# EAGLE design Test pistes (EAGLE 7.2.0)
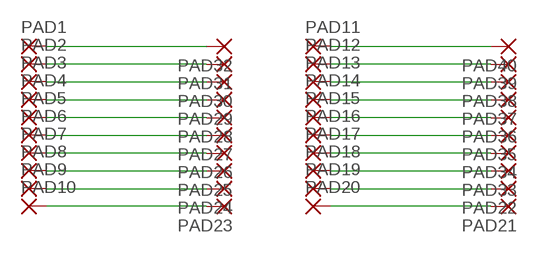
[diagram p0: schematic, sheet 1]

## Parts
PAD1  2,54/1,1  [2,54/1,1]
PAD2  2,54/1,1  [2,54/1,1]
PAD3  2,54/1,1  [2,54/1,1]
PAD4  2,54/1,1  [2,54/1,1]
PAD5  2,54/1,1  [2,54/1,1]
PAD6  2,54/1,1  [2,54/1,1]
PAD7  2,54/1,1  [2,54/1,1]
PAD8  2,54/1,1  [2,54/1,1]
PAD9  2,54/1,1  [2,54/1,1]
PAD10  2,54/1,1  [2,54/1,1]
PAD11  2,54/1,1  [2,54/1,1]
PAD12  2,54/1,1  [2,54/1,1]
PAD13  2,54/1,1  [2,54/1,1]
PAD14  2,54/1,1  [2,54/1,1]
PAD15  2,54/1,1  [2,54/1,1]
PAD16  2,54/1,1  [2,54/1,1]
PAD17  2,54/1,1  [2,54/1,1]
PAD18  2,54/1,1  [2,54/1,1]
PAD19  2,54/1,1  [2,54/1,1]
PAD20  2,54/1,1  [2,54/1,1]
PAD21  2,54/1,1  [2,54/1,1]
PAD22  2,54/1,1  [2,54/1,1]
PAD23  2,54/1,1  [2,54/1,1]
PAD24  2,54/1,1  [2,54/1,1]
PAD25  2,54/1,1  [2,54/1,1]
PAD26  2,54/1,1  [2,54/1,1]
PAD27  2,54/1,1  [2,54/1,1]
PAD28  2,54/1,1  [2,54/1,1]
PAD29  2,54/1,1  [2,54/1,1]
PAD30  2,54/1,1  [2,54/1,1]
PAD31  2,54/1,1  [2,54/1,1]
PAD32  2,54/1,1  [2,54/1,1]
PAD33  2,54/1,1  [2,54/1,1]
PAD34  2,54/1,1  [2,54/1,1]
PAD35  2,54/1,1  [2,54/1,1]
PAD36  2,54/1,1  [2,54/1,1]
PAD37  2,54/1,1  [2,54/1,1]
PAD38  2,54/1,1  [2,54/1,1]
PAD39  2,54/1,1  [2,54/1,1]
PAD40  2,54/1,1  [2,54/1,1]

## Nets
N$1: PAD1.1(P) PAD32.1(P)
N$2: PAD2.1(P) PAD31.1(P)
N$3: PAD3.1(P) PAD30.1(P)
N$4: PAD4.1(P) PAD29.1(P)
N$5: PAD5.1(P) PAD28.1(P)
N$6: PAD6.1(P) PAD27.1(P)
N$7: PAD7.1(P) PAD26.1(P)
N$8: PAD8.1(P) PAD25.1(P)
N$9: PAD9.1(P) PAD24.1(P)
N$10: PAD10.1(P) PAD23.1(P)
N$11: PAD11.1(P) PAD40.1(P)
N$12: PAD12.1(P) PAD39.1(P)
N$13: PAD13.1(P) PAD38.1(P)
N$14: PAD14.1(P) PAD37.1(P)
N$15: PAD15.1(P) PAD36.1(P)
N$16: PAD16.1(P) PAD35.1(P)
N$17: PAD17.1(P) PAD34.1(P)
N$18: PAD18.1(P) PAD33.1(P)
N$19: PAD19.1(P) PAD22.1(P)
N$20: PAD20.1(P) PAD21.1(P)

## Library data of the parts
PAD1-PAD40 = wirepad:2,54/1,1: THROUGH-HOLE PAD

## Board
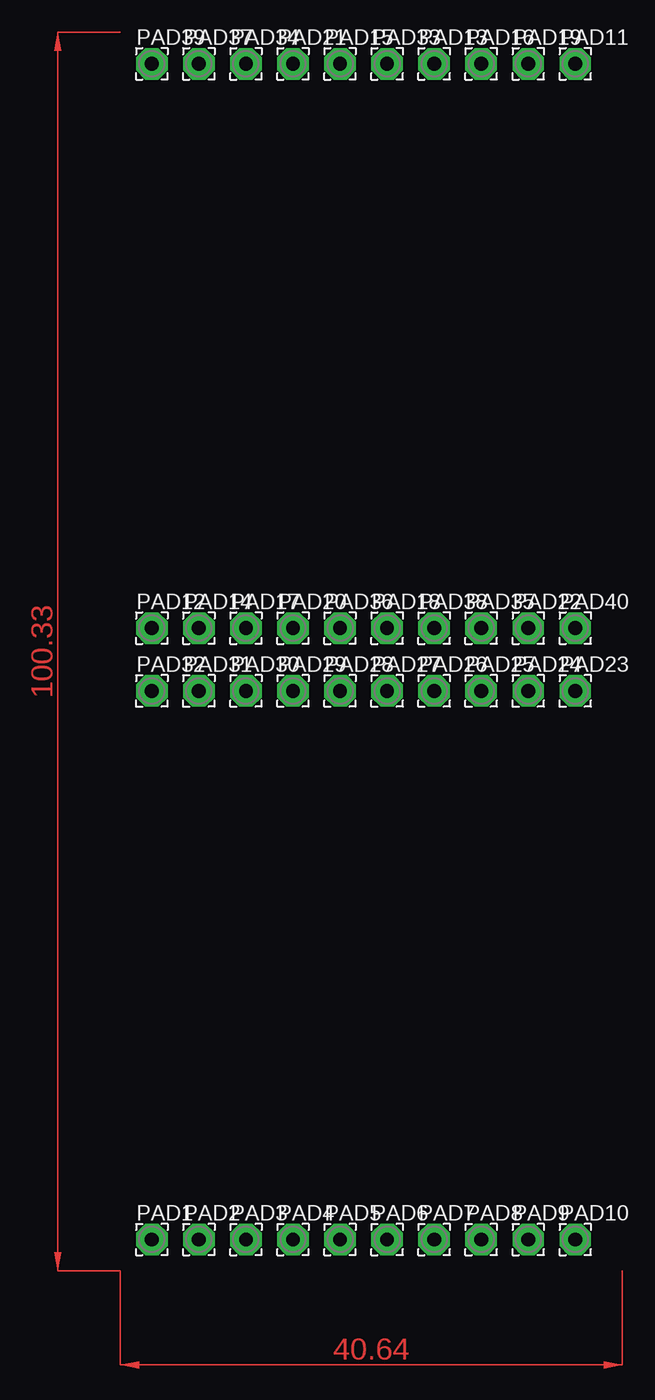
[diagram p1: board, top side]
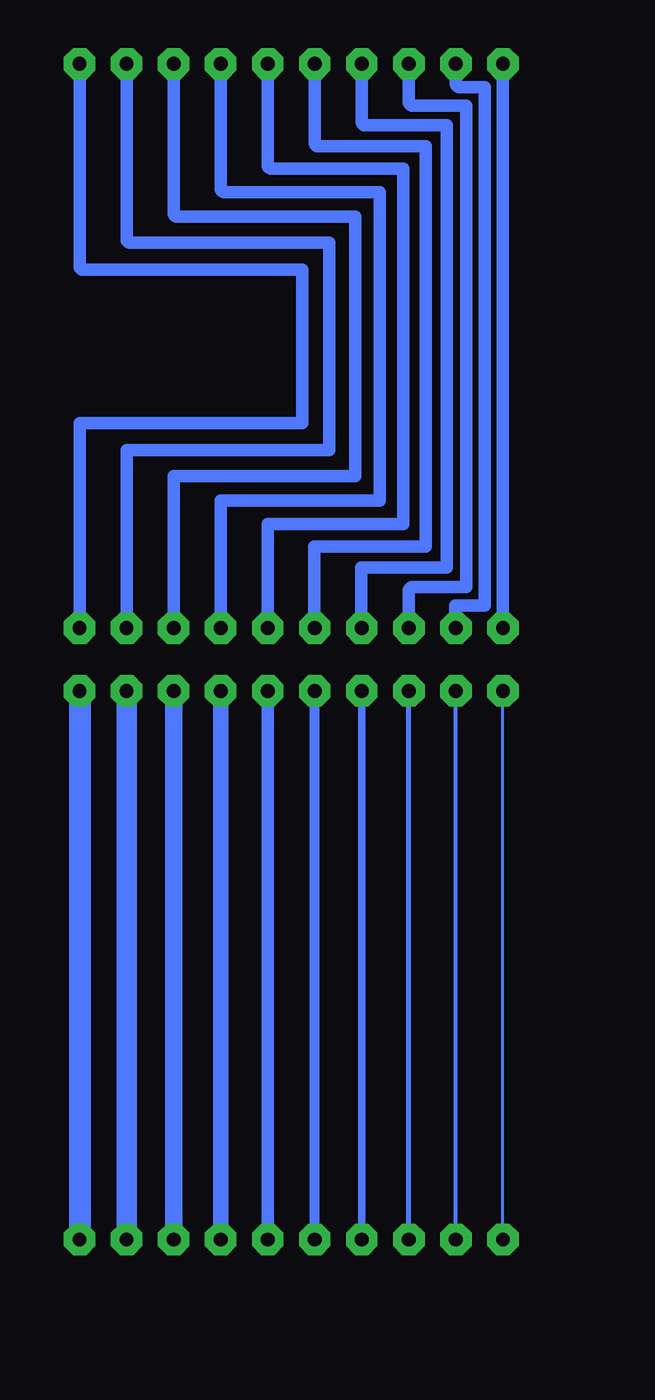
[diagram p2: board, bottom side, seen from below]

No outline drawn. Coordinates in mm, seen from the top.
Copper layers (1*16): Top 0.035mm / dielectric 1.5mm / Bottom 0.035mm
Design rules "default": minimum track width 10mil, minimum drill 24mil, track to track 8mil, track to pad 8mil, pad to pad 8mil, via to via 8mil, smd to smd 8mil, copper to edge 40mil, drill to drill 8mil, minimum pad ring 10mil, minimum via ring 8mil, stop-mask expansion 4mil, vias tented up to drill 0mil, thermal gap 10mil

### Footprints (pad centres in the part's own frame; a part is rotated, then mirrored left to right if it is on the bottom)
2,54/1,1 = drill 1.118 pad 2.54 octagon: 1 0,0

### Placement (x,y rotation side)
PAD1  2.54,2.54 0 top
PAD2  6.35,2.54 0 top
PAD3  10.16,2.54 0 top
PAD4  13.97,2.54 0 top
PAD5  17.78,2.54 0 top
PAD6  21.59,2.54 0 top
PAD7  25.4,2.54 0 top
PAD8  29.21,2.54 0 top
PAD9  33.02,2.54 0 top
PAD10  36.83,2.54 0 top
PAD11  36.83,97.79 0 top
PAD12  2.54,52.07 0 top
PAD13  25.4,97.79 0 top
PAD14  6.35,52.07 0 top
PAD15  17.78,97.79 0 top
PAD16  29.21,97.79 0 top
PAD17  10.16,52.07 0 top
PAD18  21.59,52.07 0 top
PAD19  33.02,97.79 0 top
PAD20  13.97,52.07 0 top
PAD21  13.97,97.79 0 top
PAD22  33.02,52.07 0 top
PAD23  36.83,46.99 0 top
PAD24  33.02,46.99 0 top
PAD25  29.21,46.99 0 top
PAD26  25.4,46.99 0 top
PAD27  21.59,46.99 0 top
PAD28  17.78,46.99 0 top
PAD29  13.97,46.99 0 top
PAD30  10.16,46.99 0 top
PAD31  6.35,46.99 0 top
PAD32  2.54,46.99 0 top
PAD33  21.59,97.79 0 top
PAD34  10.16,97.79 0 top
PAD35  29.21,52.07 0 top
PAD36  17.78,52.07 0 top
PAD37  6.35,97.79 0 top
PAD38  25.4,52.07 0 top
PAD39  2.54,97.79 0 top
PAD40  36.83,52.07 0 top

### Tracks (layer width: path | path; a pad name or v marks a point on that pad's centre or on a via)
N$1
  Bottom 0.254: PAD1.1 PAD32.1
N$2
  Bottom 0.305: PAD2.1 PAD31.1
N$3
  Bottom 0.406: PAD3.1 PAD30.1
N$4
  Bottom 0.61: PAD4.1 PAD29.1
N$5
  Bottom 0.813: PAD5.1 PAD28.1
N$6
  Bottom 1.016: PAD6.1 PAD27.1
N$7
  Bottom 1.27: PAD7.1 PAD26.1
N$8
  Bottom 1.422: PAD25.1 PAD8.1
N$9
  Bottom 1.676: PAD24.1 PAD9.1
N$10
  Bottom 1.778: PAD23.1 PAD10.1
N$11
  Bottom 1: PAD40.1 arc-90 36.8,52.1 36.8,68.7 18.8,68.7 18.8,81.1 36.51,81.1 arc90 36.83,81.42 PAD11.1
N$12
  Bottom 1: PAD12.1 PAD39.1
N$13
  Bottom 1: PAD38.1 25.4,62.4 12.5,62.4 12.5,87.4 25.08,87.4 arc90 25.4,87.72 PAD13.1
N$14
  Bottom 1: PAD14.1 arc90 6.4,52.12 6.4,53.9 4,53.9 4,95.9 6.03,95.9 arc90 6.35,96.22 PAD37.1
N$15
  Bottom 1: PAD36.1 arc90 17.8,52.09 17.8,58.7 8.8,58.7 8.8,91.1 17.46,91.1 arc90 17.78,91.42 PAD15.1
N$16
  Bottom 1: PAD35.1 arc-90 PAD35.1 29.2,64.4 14.5,64.4 14.5,85.4 28.89,85.4 arc90 29.21,85.72 PAD16.1
N$17
  Bottom 1: PAD17.1 10.16,55.08 arc90 9.84,55.4 5.5,55.4 5.5,94.4 9.84,94.4 arc90 10.16,94.72 PAD34.1
N$18
  Bottom 1: PAD18.1 arc90 PAD18.1 21.6,60.5 10.6,60.5 10.6,89.3 21.27,89.3 arc90 21.59,89.62 PAD33.1
N$19
  Bottom 1: PAD22.1 arc-90 33,52.09 33,66.5 16.6,66.5 16.6,83.3 32.7,83.3 arc90 33.02,83.62 PAD19.1
N$20
  Bottom 1: PAD20.1 arc90 14,52.1 14,57 7.1,57 7.1,92.8 13.65,92.8 arc90 13.97,93.12 PAD21.1
(copper drawn outside any net)
  shapes: Top area x2